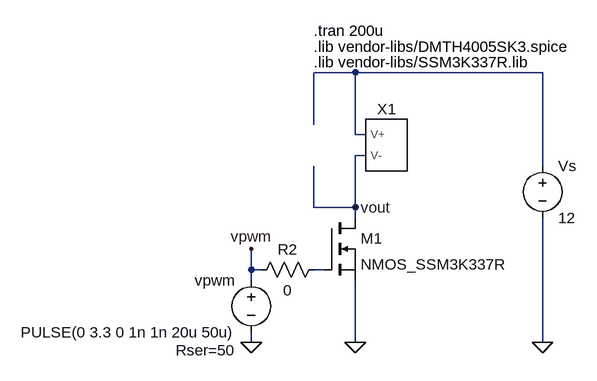
[diagram p0: schematic pwmspkr.asc]
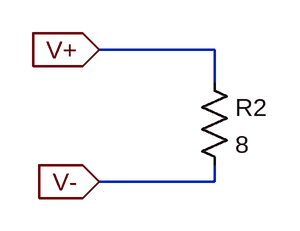
[diagram p1: sub-circuit myspkr.asc]
pwmspkr.asc, the LTspice schematic file:
Version 4
SHEET 1 1656 680
WIRE 624 -48 560 -48
WIRE 912 -48 624 -48
WIRE 560 32 560 -48
WIRE 624 48 624 -48
WIRE 640 48 624 48
WIRE 640 80 624 80
WIRE 912 96 912 -48
WIRE 560 160 560 96
WIRE 624 160 624 80
WIRE 624 160 560 160
WIRE 624 176 624 160
WIRE 464 256 464 224
WIRE 480 256 464 256
WIRE 576 256 560 256
WIRE 464 272 464 256
WIRE 464 368 464 352
WIRE 624 368 624 272
WIRE 912 368 912 176
FLAG 464 368 0
FLAG 624 368 0
FLAG 912 368 0
FLAG 464 224 vpwm
FLAG 624 160 vout
SYMBOL nmos 576 176 R0
SYMATTR InstName M1
SYMATTR Value NMOS_SSM3K337R
SYMATTR Prefix X
SYMBOL voltage 464 256 M0
WINDOW 123 0 0 Left 0
WINDOW 39 24 124 Left 2
SYMATTR SpiceLine Rser=50
SYMATTR InstName vpwm
SYMATTR Value PULSE(0 3.3 0 1n 1n 20u 50u)
SYMBOL voltage 912 80 R0
SYMATTR InstName Vs
SYMATTR Value 12
SYMBOL res 576 240 R90
WINDOW 0 0 56 VBottom 2
WINDOW 3 32 56 VTop 2
SYMATTR InstName R2
SYMATTR Value 0
SYMBOL myspkr 672 64 R0
SYMATTR InstName X1
TEXT 560 -112 Left 2 !.tran 200u
TEXT 560 -88 Left 2 !.lib vendor-libs/DMTH4005SK3.spice
TEXT 560 -64 Left 2 !.lib vendor-libs/SSM3K337R.lib

myspkr.asc, the sub-circuit schematic file:
Version 4
SHEET 1 880 680
WIRE 352 96 240 96
WIRE 352 128 352 96
WIRE 352 224 352 208
WIRE 352 224 240 224
FLAG 240 224 V-
IOPIN 240 224 In
FLAG 240 96 V+
IOPIN 240 96 In
SYMBOL res 336 112 R0
SYMATTR InstName R2
SYMATTR Value 8

The netlist it stands for:
* pwmspkr.asc
XM1 vout N002 0 NMOS_SSM3K337R  ; pins D G S
vpwm vpwm 0 PULSE(0 3.3 0 1n 1n 20u 50u) Rser=50
Vs N001 0 12
R2 N002 vpwm 0
XX1 N001 vout myspkr

* block symbol definitions
.subckt myspkr V+ V-
R2 V+ V- 8
.ends myspkr

.tran 200u
.lib vendor-libs/DMTH4005SK3.spice
.lib vendor-libs/SSM3K337R.lib
.backanno
.end